# Altium schematic sheet 4KB_SRAM_Module_SCH_ALTIUM.schdoc
size 154 x 134 mm
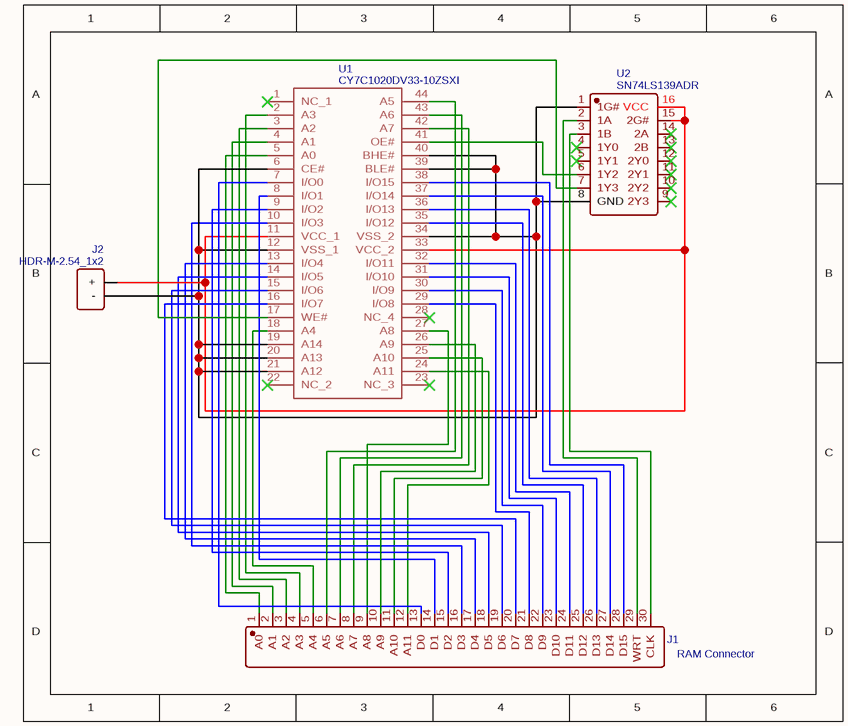
[diagram p0: 4KB_SRAM_Module_SCH_ALTIUM.schdoc]

## Parts
J1  RAM Connector  [30-SIP-WITH-NOTCH]
J2  HDR-M-2.54_1x2  [HDR-M-2.54_1X2]
U1  CY7C1020DV33-10ZSXI  [SOP80P1184X119-44N]
U2  SN74LS139ADR  [SOIC-16_L9.9-W3.9-P1.27-LS6.0-BL]

## Nets
NetJ1_1: J1.1(A0) U1.5(A0)
NetJ1_2: J1.2(A1) U1.4(A1)
NetJ1_3: J1.3(A2) U1.3(A2)
NetJ1_4: J1.4(A3) U1.2(A3)
NetJ1_5: J1.5(A4) U1.18(A4)
NetJ1_6: J1.6(A5) U1.44(A5)
NetJ1_7: J1.7(A6) U1.43(A6)
NetJ1_8: J1.8(A7) U1.42(A7)
NetJ1_9: J1.9(A8) U1.27(A8)
NetJ1_10: J1.10(A9) U1.26(A9)
NetJ1_11: J1.11(A10) U1.25(A10)
NetJ1_12: J1.12(A11) U1.24(A11)
NetJ1_13: J1.13(D0) U1.7(I/O0)
NetJ1_14: J1.14(D1) U1.8(I/O1)
NetJ1_15: J1.15(D2) U1.9(I/O2)
NetJ1_16: J1.16(D3) U1.10(I/O3)
NetJ1_17: J1.17(D4) U1.13(I/O4)
NetJ1_18: J1.18(D5) U1.14(I/O5)
NetJ1_19: J1.19(D6) U1.15(I/O6)
NetJ1_20: J1.20(D7) U1.16(I/O7)
NetJ1_21: J1.21(D8) U1.29(I/O8)
NetJ1_22: J1.22(D9) U1.30(I/O9)
NetJ1_23: J1.23(D10) U1.31(I/O10)
NetJ1_24: J1.24(D11) U1.32(I/O11)
NetJ1_25: J1.25(D12) U1.35(I/O12)
NetJ1_26: J1.26(D13) U1.36(I/O13)
NetJ1_27: J1.27(D14) U1.37(I/O14)
NetJ1_28: J1.28(D15) U1.38(I/O15)
NetJ1_29: J1.29(WRT) U2.2(1A)
NetJ1_30: J1.30(CLK) U2.3(1B)
NetJ2_1: J2.1(+) U1.11(VCC_1) U1.33(VCC_2) U2.15(2G#) U2.16(VCC)
NetJ2_2: J2.2(-) U1.6(CE#) U1.12(VSS_1) U1.19(A14) U1.20(A13) U1.21(A12) U1.34(VSS_2) U1.39(BLE#) U1.40(BHE#) U2.1(1G#) U2.8(GND)
NetU1_17: U1.17(WE#) U2.7(1Y3)
NetU1_41: U1.41(OE#) U2.6(1Y2)

Not connected (* = marked no-connect by the designer): U1 1(NC_1)* 22(NC_2)* 23(NC_3)* 28(NC_4)*; U2 4(1Y0)* 5(1Y1)* 9(2Y3)* 10(2Y2)* 11(2Y1)* 12(2Y0)* 13(2B)* 14(2A)*

## Library data of the parts
J2 = HDR-M-2.54_1x2: Contributor: LCEDA_Lib; BOM_Supplier Part: C124375; BOM_Supplier: LCSC; spicePre: J; spiceSymbolName: HDR-M-2.54_1x2
U1 = CY7C1020DV33-10ZSXI: Contributor: shawleonm; spicePre: I; spiceSymbolName: CY7C1020DV33-10ZSXI
U2 = SN74LS139ADR: BOM_Manufacturer: TI(德州仪器); Contributor: LCSC; BOM_Supplier: LCSC; BOM_Supplier Part: C7738; BOM_Manufacturer Part: SN74LS139ADR; BOM_JLCPCB Part Class: Extended Part; spicePre: U; spiceSymbolName: SN74LS139ADR
J1 = RAM Connector: spicePre: X; spiceSymbolName: R.C.